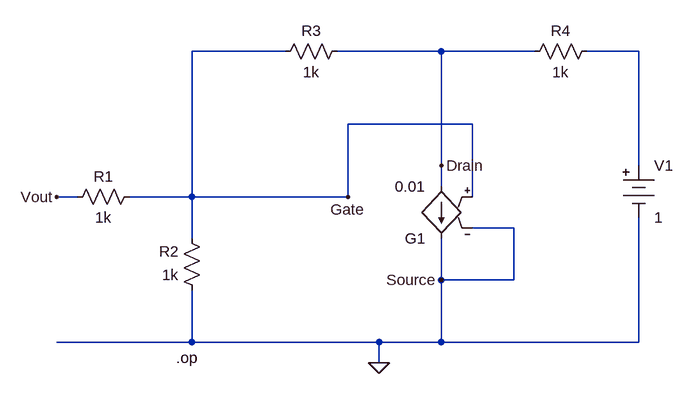
[diagram p0: schematic g3_p22.asc]
g3_p22.asc, the LTspice schematic file:
Version 4
SHEET 1 880 680
WIRE 80 -48 -64 -48
WIRE 320 -48 160 -48
WIRE 464 -48 320 -48
WIRE 624 -48 544 -48
WIRE 368 64 176 64
WIRE 320 128 320 -48
WIRE 624 128 624 -48
WIRE 320 160 320 128
WIRE -240 176 -272 176
WIRE -64 176 -64 -48
WIRE -64 176 -160 176
WIRE 176 176 176 64
WIRE 176 176 -64 176
WIRE 368 176 368 64
WIRE 432 224 368 224
WIRE -64 240 -64 176
WIRE 320 304 320 240
WIRE 432 304 432 224
WIRE 432 304 320 304
WIRE -64 400 -64 320
WIRE -64 400 -272 400
WIRE 224 400 -64 400
WIRE 320 400 320 304
WIRE 320 400 224 400
WIRE 624 400 624 208
WIRE 624 400 320 400
WIRE 224 432 224 400
FLAG 176 176 Gate
FLAG 320 304 Source
FLAG 320 128 Drain
FLAG 224 432 0
FLAG -272 176 Vout
SYMBOL Misc\\battery 624 112 R0
SYMATTR InstName V1
SYMATTR Value 1
SYMBOL g2 320 256 R180
SYMATTR InstName G1
SYMATTR Value 0.01
SYMBOL res 560 -64 R90
WINDOW 0 0 56 VBottom 2
WINDOW 3 32 56 VTop 2
SYMATTR InstName R4
SYMATTR Value 1k
SYMBOL res 176 -64 R90
WINDOW 0 0 56 VBottom 2
WINDOW 3 32 56 VTop 2
SYMATTR InstName R3
SYMATTR Value 1k
SYMBOL res -144 160 R90
WINDOW 0 0 56 VBottom 2
WINDOW 3 32 56 VTop 2
SYMATTR InstName R1
SYMATTR Value 1k
SYMBOL res -48 336 R180
WINDOW 0 36 76 Left 2
WINDOW 3 36 40 Left 2
SYMATTR InstName R2
SYMATTR Value 1k
TEXT -88 424 Left 2 !.op

The netlist it stands for:
* g3_p22.asc
V1 N001 0 1
G1 Drain 0 Gate 0 0.01
R4 N001 Drain 1k
R3 Drain Gate 1k
R1 Gate Vout 1k
R2 0 Gate 1k
.op
.backanno
.end